# Altium schematic sheet power.SchDoc
size A4
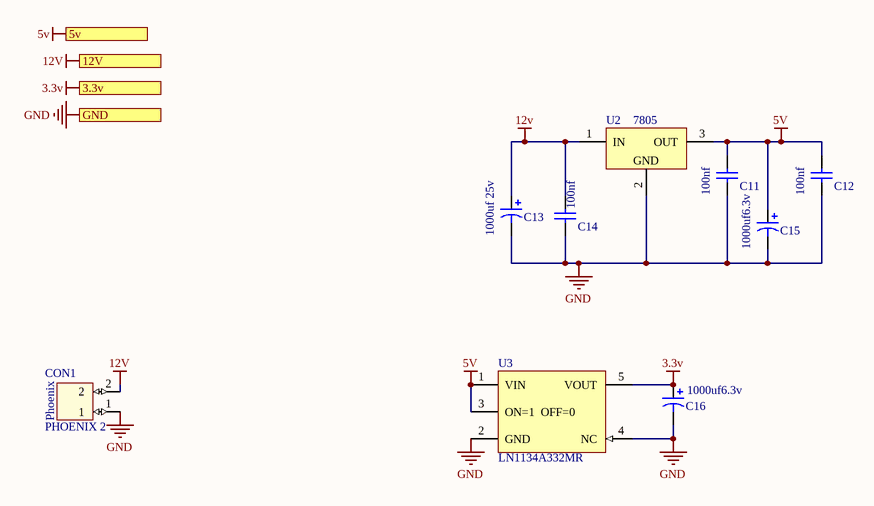
[diagram p0: power.SchDoc]

## Parts
C11  Valu: 100nf  [RES 1206 (3216X08L)]  (hidden comment: Non Polarity)
C12  Valu: 100nf  [RES 0805 (2012X06L)]  (hidden comment: Non Polarity)
C13  Valu: 1000uf 25v  [RB5-10.5]  (hidden comment: Polarity)
C14  Valu: 100nf  [RES 0805 (2012X06L)]  (hidden comment: Non Polarity)
C15  Valu: 1000uf6.3v  [RB5-10]  (hidden comment: Polarity)
C16  Valu: 1000uf6.3v  [RB5-10]  (hidden comment: Polarity)
CON1  PHOENIX 2  [phonix 2]
U2  7805  [reg SMD1A small]
U3  LN1134A332MR  [SOT23-5_N]

## Ports
3.3v, 5v, 12V, GND

## Nets
3.3v: C16.1 U3.5(VOUT) ; port 3.3v
5V: C11.2 C12.2 C15.1 U2.3(OUT) U3.1(VIN) U3.3(ON=1__OFF=0) ; port 5v
12V: C13.1 C14.2 CON1.2 U2.1(IN) ; port 12V
GND: C11.1 C12.1 C13.2 C14.1 C15.2 C16.2 CON1.1 U2.2(GND) U3.2(GND) U3.4(NC) ; port GND

## Notes on the sheet
- (in symbol PHOENIX 2) Phoenix

## Library data of the parts
C11 C12 C14 = Cap
C13 C15 C16 = Cap_Polarity
CON1 = PHOENIX 2: pin to pad: 1>2 2>1
U2 = 78XX
U3 = LN1134A332MR: Voltage - Input (Max): 7v; Voltage - Output (Fixed): 3.3v; Output Current: 300mA; PackageDescription: 5-Pin Small Outline Transistor Package, Body 2.9 x 1.6 mm, Pitch 0.95 mm